# EAGLE schematic lightclock.0 (EAGLE 6.2)
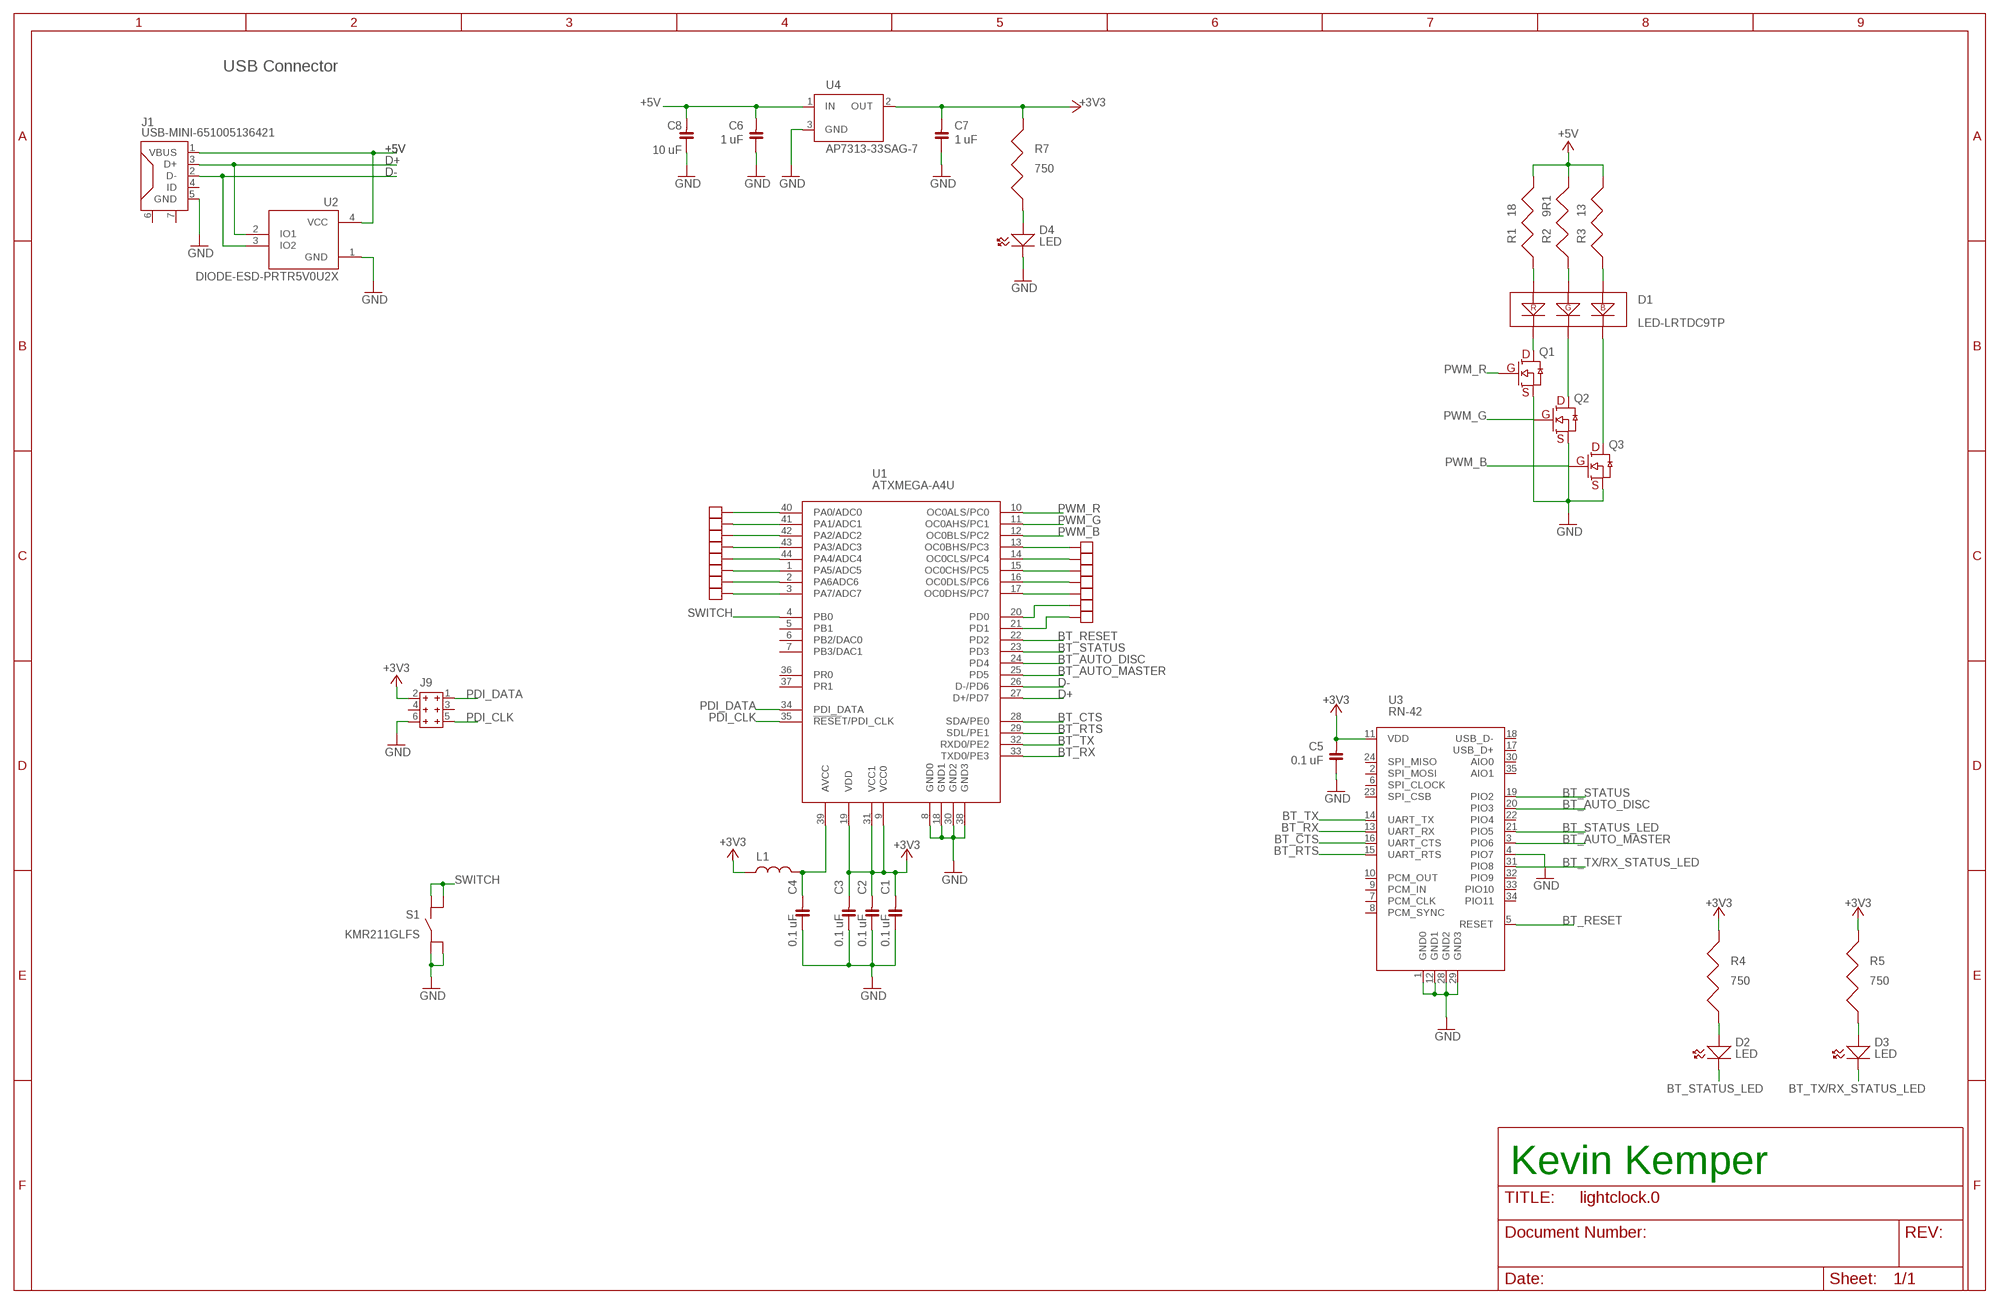
[diagram p0: schematic, sheet 1]

## Parts
C1  0.1 uF  CAP-0603  [0603]
C2  0.1 uF  CAP-0603  [0603]
C3  0.1 uF  CAP-0603  [0603]
C4  0.1 uF  CAP-0603  [0603]
C5  0.1 uF  CAP-0603  [0603]
C6  1 uF  CAP-0603  [0603]
C7  1 uF  CAP-0603  [0603]
C8  10 uF  CAP-0805  [0805]
D1  LED-LRTDC9TP  [LRTDC9TP-EAFB-GHQN]
D2  LED  [0603-POL]
D3  LED  [0603-POL]
D4  LED  [0603-POL]
J1  USB-MINI-651005136421  [651005136421]
J2  TESTPAD  [HEADER-1X1]
J3  TESTPAD  [HEADER-1X1]
J4  TESTPAD  [HEADER-1X1]
J5  TESTPAD  [HEADER-1X1]
J6  TESTPAD  [HEADER-1X1]
J7  TESTPAD  [HEADER-1X1]
J8  TESTPAD  [HEADER-1X1]
J9  HEADER-2X6  [HEADER-2X6]
J10  TESTPAD  [HEADER-1X1]
J11  TESTPAD  [HEADER-1X1]
J12  TESTPAD  [HEADER-1X1]
J13  TESTPAD  [HEADER-1X1]
J14  TESTPAD  [HEADER-1X1]
J15  TESTPAD  [HEADER-1X1]
J16  TESTPAD  [HEADER-1X1]
J17  TESTPAD  [HEADER-1X1]
L1  IND-0603  [0603]
Q1  BSS138  [SOT-23]
Q2  BSS138  [SOT-23]
Q3  BSS138  [SOT-23]
R1  18  RES2010  [2010]
R2  9R1  RES2010  [2010]
R3  13  RES2010  [2010]
R4  750  RES-0603  [0603]
R5  750  RES-0603  [0603]
R7  750  RES-0603  [0603]
S1  KMR211GLFS  [KMR211GLFS]
U1  ATXMEGA-A4U  [ATXMEGA16A4U-AUR]
U2  DIODE-ESD-PRTR5V0U2X  [PRTR5V0U2X]
U3  RN-42  [RN-42]
U4  AP7313-33SAG-7  [AP7313-33SAG-7]

## Nets
+3V3: C1.1 C2.1 C3.1 C5.1 C7.1 J9.2 L1.1 R4.2 R5.2 R7.2 U1.9(VCC0) U1.19(VDD) U1.31(VCC1) U3.11(VDD) U4.2(OUT)
+5V: C6.1 C8.1 J1.1(VBUS) R1.2 R2.2 R3.2 U2.4(VCC) U4.1(IN)
BT_AUTO_DISC: U1.24(PD4) U3.20(PIO3)
BT_AUTO_MASTER: U1.25(PD5) U3.3(PIO6)
BT_CTS: U1.28(SDA/PE0) U3.16(UART_CTS)
BT_RESET: U1.22(PD2) U3.5(RESET)
BT_RTS: U1.29(SDL/PE1) U3.15(UART_RTS)
BT_RX: U1.33(TXD0/PE3) U3.13(UART_RX)
BT_STATUS: U1.23(PD3) U3.19(PIO2)
BT_STATUS_LED: D2.2 U3.21(PIO5)
BT_TX: U1.32(RXD0/PE2) U3.14(UART_TX)
BT_TX/RX_STATUS_LED: D3.2 U3.31(PIO8)
D+: J1.3(D+) U1.27(D+/PD7) U2.2(IO1)
D-: J1.2(D-) U1.26(D-/PD6) U2.3(IO2)
GND: C1.2 C2.2 C3.2 C4.2 C5.2 C6.2 C7.2 C8.2 D4.2 J1.5(GND) J9.6 Q1.2(S) Q2.2(S) Q3.2(S) S1.1 S1.2 U1.8(GND0) U1.18(GND1) U1.30(GND2) U1.38(GND3) U2.1(GND) U3.1(GND0) U3.4(PIO7) U3.12(GND1) U3.28(GND2) U3.29(GND3) U4.3(GND)
N$1: C4.1 L1.2 U1.39(AVCC)
N$2: D2.1 R4.1
N$3: D1.A1 R1.1
N$4: D1.A2 R2.1
N$5: D1.A3 R3.1
N$6: D3.1 R5.1
N$7: D1.C1 Q1.3(D)
N$8: D1.C2 Q2.3(D)
N$9: D1.C3 Q3.3(D)
N$10: D4.1 R7.1
N$11: J7.1 U1.20(PD0)
N$13: J8.1 U1.21(PD1)
N$14: J6.1 U1.17(OC0DHS/PC7)
N$15: J5.1 U1.16(OC0DLS/PC6)
N$16: J4.1 U1.15(OC0CHS/PC5)
N$17: J3.1 U1.14(OC0CLS/PC4)
N$18: J2.1 U1.13(OC0BHS/PC3)
N$20: J10.1 U1.40(PA0/ADC0)
N$21: J11.1 U1.41(PA1/ADC1)
N$22: J12.1 U1.42(PA2/ADC2)
N$23: J13.1 U1.43(PA3/ADC3)
N$24: J14.1 U1.44(PA4/ADC4)
N$25: J15.1 U1.1(PA5/ADC5)
N$26: J16.1 U1.2(PA6ADC6)
N$27: J17.1 U1.3(PA7/ADC7)
PDI_CLK: J9.5 U1.35(!RESE!T/PDI_CLK)
PDI_DATA: J9.1 U1.34(PDI_DATA)
PWM_B: Q3.1(G) U1.12(OC0BLS/PC2)
PWM_G: Q2.1(G) U1.11(OC0AHS/PC1)
PWM_R: Q1.1(G) U1.10(OC0ALS/PC0)
SWITCH: S1.3 S1.4 U1.4(PB0)
Unconnected: J1.4(ID) J1.6(SHEILD1) J1.7(SHEILD2) J9.3 J9.4 U1.5(PB1) U1.6(PB2/DAC0) U1.7(PB3/DAC1) U1.36(PR0) U1.37(PR1) U3.2(SPI_MOSI) U3.6(SPI_CLOCK) U3.7(PCM_CLK) U3.8(PCM_SYNC) U3.9(PCM_IN) U3.10(PCM_OUT) U3.17(USB_D+) U3.18(USB_D-) U3.22(PIO4) U3.23(SPI_CSB) U3.24(SPI_MISO) U3.30(AIO0) U3.32(PIO9) U3.33(PIO10) U3.34(PIO11) U3.35(AIO1)

## Notes on the sheet
- USB Connector
- Kevin Kemper

## Library data of the parts
C1-C7 = Kemper-Passives:CAP-0603
C8 = Kemper-Passives:CAP-0805
D1 = Kemper-Passives:LED-LRTDC9TP: Bright ass tri color led. 250 mA max If per diode R: Vf = 2.35 G: Vf = 3.5 B: Vf = 3.4; DIGIKEY: 475-2856-1-ND
D2-D4 = Kemper-Passives:LED
J1 = Kemper-Connectors:USB-MINI-651005136421; DIGIKEY: 732-2735-ND
J2-J8 J10-J17 = Kemper-Connectors:TESTPAD
J9 = Kemper-Connectors:HEADER-2X6
L1 = Kemper-Passives:IND-0603
Q1-Q3 = Kemper-Passives:BSS138
R1-R3 = Kemper-Passives:RES
R4 R5 R7 = Kemper-Passives:RES-0603
S1 = Kemper-ElectroMechanical:KMR211GLFS
U1 = Kemper-DigitalIC:ATXMEGA-A4U; DIGIKEY: ATXMEGA16A4U-AURCT-ND
U2 = Kemper-Passives:DIODE-ESD-PRTR5V0U2X; DIGIKEY: 568-4140-1-ND
U3 = Kemper-DigitalIC:RN-42; SPARKFUN: WRL-10253
U4 = Kemper-DigitalIC:AP7313-33SAG-7